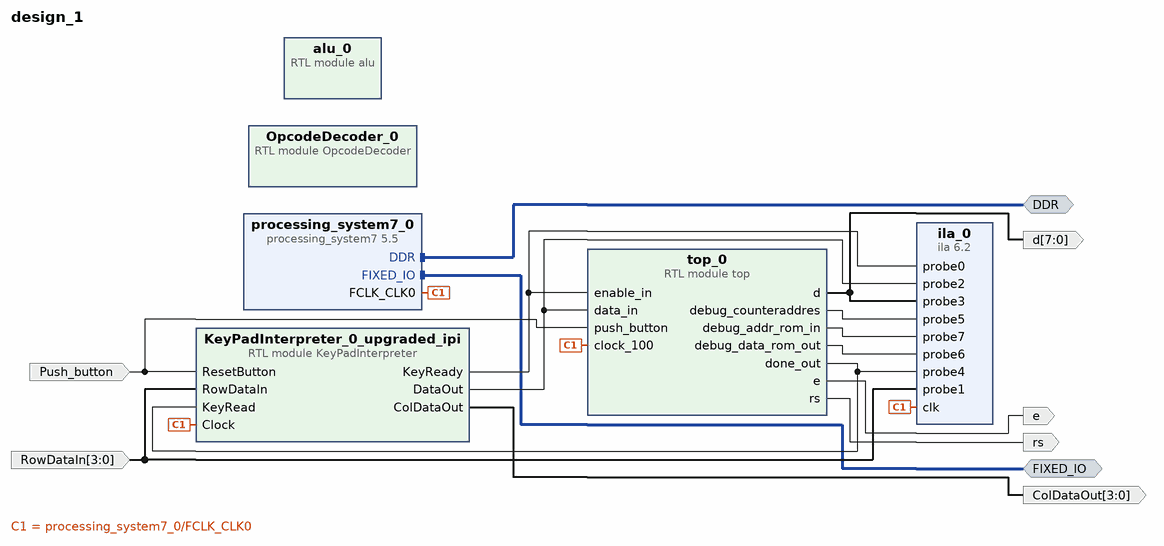
[diagram p0: block diagram of the top level]
# Vivado block design design_1, xc7z007sclg225-1, Vivado 2019.1
create_bd_design design_1

create_bd_intf_port -mode Master -vlnv xilinx.com:interface:ddrx_rtl:1.0 DDR
create_bd_intf_port -mode Master -vlnv xilinx.com:display_processing_system7:fixedio_rtl:1.0 FIXED_IO
create_bd_port -dir O rs
create_bd_port -dir O e
create_bd_port -dir O -from 7 -to 0 d
create_bd_port -dir I Push_button
create_bd_port -dir O -from 3 -to 0 ColDataOut
create_bd_port -dir I -from 3 -to 0 -type intr RowDataIn
set_property -dict {CONFIG.PortWidth 4 CONFIG.SENSITIVITY EDGE_FALLING} [get_bd_ports RowDataIn]

create_bd_cell -type ip -vlnv xilinx.com:ip:processing_system7:5.5 processing_system7_0
set_property -dict [list \
  CONFIG.PCW_APU_PERIPHERAL_FREQMHZ 666.666666 \
  CONFIG.PCW_DM_WIDTH 2 \
  CONFIG.PCW_DQS_WIDTH 2 \
  CONFIG.PCW_DQ_WIDTH 16 \
  CONFIG.PCW_ENET0_PERIPHERAL_ENABLE 0 \
  CONFIG.PCW_EN_RST0_PORT 0 \
  CONFIG.PCW_FPGA0_PERIPHERAL_FREQMHZ 100 \
  CONFIG.PCW_FPGA1_PERIPHERAL_FREQMHZ 10 \
  CONFIG.PCW_GPIO_MIO_GPIO_ENABLE 0 \
  CONFIG.PCW_MIO_PRIMITIVE 32 \
  CONFIG.PCW_PRESET_BANK1_VOLTAGE {LVCMOS 3.3V} \
  CONFIG.PCW_QSPI_PERIPHERAL_ENABLE 0 \
  CONFIG.PCW_SD0_PERIPHERAL_ENABLE 0 \
  CONFIG.PCW_UART1_PERIPHERAL_ENABLE 0 \
  CONFIG.PCW_UIPARAM_DDR_BUS_WIDTH {16 Bit} \
  CONFIG.PCW_UIPARAM_DDR_FREQ_MHZ 533.333333 \
  CONFIG.PCW_UIPARAM_DDR_MEMORY_TYPE {DDR 3 (Low Voltage)} \
  CONFIG.PCW_UIPARAM_DDR_PARTNO {MT41K256M16 RE-125} \
  CONFIG.PCW_USB0_PERIPHERAL_ENABLE 0 \
  CONFIG.PCW_USE_M_AXI_GP0 0 \
] [get_bd_cells processing_system7_0]
# 223 more settings of processing_system7_0 are not shown: defaults, MIO pin electricals, DDR timing, and values the tool derives
create_bd_cell -type ip -vlnv xilinx.com:ip:ila:6.2 ila_0
set_property -dict [list \
  CONFIG.ALL_PROBE_SAME_MU false \
  CONFIG.ALL_PROBE_SAME_MU_CNT 2 \
  CONFIG.C_DATA_DEPTH 1024 \
  CONFIG.C_ENABLE_ILA_AXI_MON false \
  CONFIG.C_EN_STRG_QUAL 0 \
  CONFIG.C_MONITOR_TYPE Native \
  CONFIG.C_NUM_OF_PROBES 8 \
  CONFIG.C_PROBE0_MU_CNT 1 \
  CONFIG.C_PROBE0_TYPE 0 \
  CONFIG.C_PROBE1_MU_CNT 4 \
  CONFIG.C_PROBE1_WIDTH 4 \
  CONFIG.C_PROBE2_MU_CNT 9 \
  CONFIG.C_PROBE2_WIDTH 9 \
  CONFIG.C_PROBE3_MU_CNT 8 \
  CONFIG.C_PROBE3_WIDTH 8 \
  CONFIG.C_PROBE4_MU_CNT 1 \
  CONFIG.C_PROBE4_TYPE 0 \
  CONFIG.C_PROBE5_MU_CNT 6 \
  CONFIG.C_PROBE5_WIDTH 6 \
  CONFIG.C_PROBE6_MU_CNT 9 \
  CONFIG.C_PROBE6_WIDTH 9 \
  CONFIG.C_PROBE7_MU_CNT 6 \
  CONFIG.C_PROBE7_WIDTH 6 \
  CONFIG.C_TRIGIN_EN false \
  CONFIG.C_TRIGOUT_EN false \
] [get_bd_cells ila_0]
create_bd_cell -type module -reference KeyPadInterpreter KeyPadInterpreter_0_upgraded_ipi
create_bd_cell -type module -reference top top_0
create_bd_cell -type module -reference OpcodeDecoder OpcodeDecoder_0
create_bd_cell -type module -reference alu alu_0

# ---- connections ----

connect_bd_intf_net [get_bd_intf_ports DDR] [get_bd_intf_pins processing_system7_0/DDR]
connect_bd_intf_net [get_bd_intf_ports FIXED_IO] [get_bd_intf_pins processing_system7_0/FIXED_IO]
connect_bd_net [get_bd_pins top_0/rs] [get_bd_ports rs]
connect_bd_net [get_bd_pins top_0/e] [get_bd_ports e]
connect_bd_net [get_bd_pins top_0/d] [get_bd_ports d] [get_bd_pins ila_0/probe3]
connect_bd_net [get_bd_ports Push_button] [get_bd_pins KeyPadInterpreter_0_upgraded_ipi/ResetButton] [get_bd_pins top_0/push_button]
connect_bd_net [get_bd_pins KeyPadInterpreter_0_upgraded_ipi/KeyReady] [get_bd_pins ila_0/probe0] [get_bd_pins top_0/enable_in]
connect_bd_net [get_bd_pins KeyPadInterpreter_0_upgraded_ipi/DataOut] [get_bd_pins ila_0/probe2] [get_bd_pins top_0/data_in]
connect_bd_net [get_bd_pins KeyPadInterpreter_0_upgraded_ipi/ColDataOut] [get_bd_ports ColDataOut]
connect_bd_net [get_bd_ports RowDataIn] [get_bd_pins ila_0/probe1] [get_bd_pins KeyPadInterpreter_0_upgraded_ipi/RowDataIn]
connect_bd_net [get_bd_pins processing_system7_0/FCLK_CLK0] \
  [get_bd_pins ila_0/clk] [get_bd_pins KeyPadInterpreter_0_upgraded_ipi/Clock] [get_bd_pins top_0/clock_100]
connect_bd_net -net top_0_debug_address [get_bd_pins top_0/debug_counteraddres] [get_bd_pins ila_0/probe5]
connect_bd_net [get_bd_pins top_0/done_out] [get_bd_pins ila_0/probe4] [get_bd_pins KeyPadInterpreter_0_upgraded_ipi/KeyRead]
connect_bd_net [get_bd_pins top_0/debug_addr_rom_in] [get_bd_pins ila_0/probe7]
connect_bd_net [get_bd_pins top_0/debug_data_rom_out] [get_bd_pins ila_0/probe6]

validate_bd_design
save_bd_design
